# Altium schematic sheet CH340G_Test.SchDoc
size A4
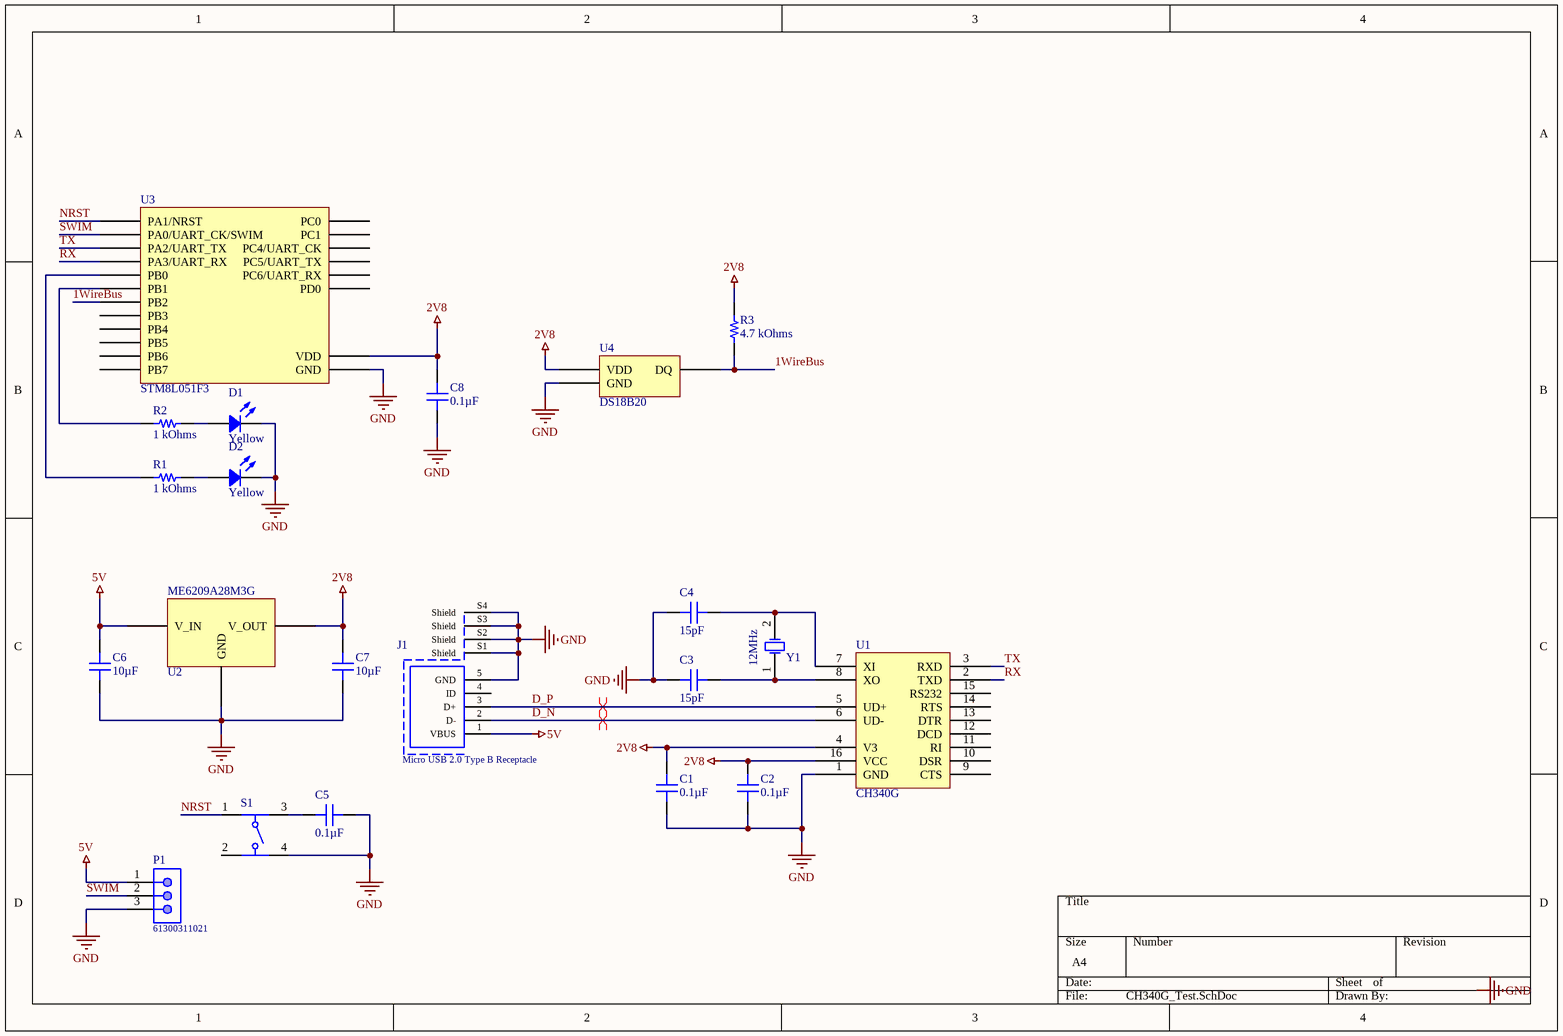
[diagram p0: CH340G_Test.SchDoc]

## Parts
C1  value 0.1µF  [CAP 0805_2012]  (hidden comment: 100nF)
C2  value 0.1µF  [CAP 0805_2012]  (hidden comment: 100nF)
C3  15pF  [CAP 0805_2012]
C4  15pF  [CAP 0805_2012]
C5  value 0.1µF  [CAP 0805_2012]  (hidden comment: 100nF)
C6  value 10µF  [CAP 0805_2012]  (hidden comment: 10uF)
C7  value 10µF  [CAP 0805_2012]  (hidden comment: 10uF)
C8  value 0.1µF  [CAP 0805_2012]  (hidden comment: 100nF)
D1  Yellow  [LED 0603_1608 YELLOW]
D2  Yellow  [LED 0603_1608 YELLOW]
J1  Micro USB 2.0 Type B Receptacle  [629105136821]
P1  61300311021  [61300311021]
R1  value 1 kOhms  [RES 0805_2012]  (hidden comment: 1k)
R2  value 1 kOhms  [RES 0805_2012]  (hidden comment: 1k)
R3  value 4.7 kOhms  [RES 0805_2012]  (hidden comment: 4K7)
S1  (no value)  [4301x60507x6]
U1  CH340G  [CH340G]
U2  ME6209A28M3G  [SOT95P285X150-3N]
U3  STM8L051F3  [TSOP65P630X120-20N]
U4  DS18B20  [DS18B20]
Y1  12MHz  [WE-XTAL_HC49/4H]

## Nets
2V8: C1.2 C2.2 C7.2 C8.1 R3.2 U1.4(V3) U1.16(VCC) U2.2(V_OUT) U3.8(VDD) U4.3(VDD)
5V: C6.2 J1.1(VBUS) P1.1 U2.3(V_IN)
GND: C1.1 C2.1 C3.1 C4.1 C5.1 C6.1 C7.1 C8.2 D1.2 D2.2 J1.5(GND) J1.S1(Shield) J1.S2(Shield) J1.S3(Shield) J1.S4(Shield) P1.3 S1.4 U1.1(GND) U2.1(GND) U3.7(GND) U4.1(GND)
1WireBus: R3.1 U3.12(PB2) U4.2(DQ)
D_N: J1.2(D-) U1.6(UD-)
D_P: J1.3(D+) U1.5(UD+)
NRST: S1.1 U3.4(PA1/NRST)
RX: U1.2(TXD) U3.6(PA3/UART_RX)
SWIM: P1.2 U3.3(PA0/UART_CK/SWIM)
TX: U1.3(RXD) U3.5(PA2/UART_TX)
NetC3_2: C3.2 U1.8(XO) Y1.1(OSC1)
NetC4_2: C4.2 U1.7(XI) Y1.2(OSC2)
NetC5_2: C5.2 S1.3
NetD1_1: D1.1 R2.2
NetD2_1: D2.1 R1.2
NetR1_1: R1.1 U3.10(PB0)
NetR2_1: R2.1 U3.11(PB1)

Not connected (* = marked no-connect by the designer): J1 4(ID); S1 2; U1 9(CTS) 10(DSR) 11(RI) 12(DCD) 13(DTR) 14(RTS) 15(RS232); U3 1(PC5/UART_TX) 2(PC6/UART_RX) 9(PD0) 13(PB3) 14(PB4) 15(PB5) 16(PB6) 17(PB7) 18(PC0) 19(PC1) 20(PC4/UART_CK)

## Layout directives
differential pair: D_N, D_P

## Notes on the sheet
- Labels drawn without touching a wire or pin: GND

## Library data of the parts
C1 C2 C5 C8 = AC0805KKX8R9BB104: CAP CER 0805 10% X8R 50V 100NF; Manufacturer: Yageo; Part Number: AC0805KKX8R9BB104; Applications: Automotive; Capacitance: 0.1µF; ComponentLink1Description: Datasheet; ComponentLink1URL: http://www.yageo.com/documents/recent/AC0805KKX8R9BB104.pdf; ComponentLink2Description: DigiKey Link; ComponentLink2URL: http://digikey.com/product-detail/en/yageo/AC0805KKX8R9BB104/311-4624-1-ND/9699550; Device Package: 0805 (2012 Metric); LastUpdated: 21/01/2020 00:02:48; Lifecycle Status: Active; Minimum Order: 1; Mounting Type: Surface Mount, MLCC; Operating Temperature: -55°C ~ 150°C; Package / Case: 0805 (2012 Metric); Packaging: TapeAndReel; PartId: 14076; Part Status: Active; Price: 0.06; Ratings: AEC-Q200; Series: AC; Size / Dimension: 0.079" L x 0.049" W (2.00mm x 1.25mm); Supplier 1: DigiKey; Supplier Part Number 1: 311-4624-1-ND; Temperature Coefficient: X8R; Thickness (Max): 0.057" (1.45mm); Tolerance: ±10%; Voltage - Rated: 50V
C3 C4 = 885012007029: CAP CER 15PF 25V C0G/NP0 0805; Manufacturer: Würth Elektronik; Temperature Coefficient: C0G, NP0; Tolerance: ±5%; Part Number: 885012007029; Value: 15pF; Applications: General Purpose; Capacitance: 15pF; ComponentLink1Description: Datasheet; ComponentLink1URL: https://katalog.we-online.de/pbs/datasheet/885012007029.pdf; ComponentLink2Description: DigiKey Link; ComponentLink2URL: http://digikey.com/product-detail/en/w-rth-elektronik/885012007029/732-7828-1-ND/5454455; Device Package: 0805 (2012 Metric); LastUpdated: 21/01/2020 00:03:03; Lifecycle Status: Active; Minimum Order: 1; Mounting Type: Surface Mount, MLCC; Operating Temperature: -55°C ~ 125°C; Package / Case: 0805 (2012 Metric); Packaging: TapeAndReel; PartId: 4245; Part Status: Active; Price: 0.03; Series: WCAP-CSGP; Size / Dimension: 0.079" L x 0.049" W (2.00mm x 1.25mm); Supplier 1: DigiKey; Supplier Part Number 1: 732-7828-1-ND; Thickness (Max): 0.028" (0.70mm); Voltage - Rated: 25V
C6 C7 = C0805X106K9RAC7800: CAP CER 10UF 6.3V X7R 0805; Manufacturer: KEMET; Tolerance: ±10%; Part Number: C0805X106K9RAC7800; Applications: Boardflex Sensitive; Capacitance: 10µF; ComponentLink1Description: Datasheet; ComponentLink1URL: https://api.kemet.com/component-edge/download/datasheet/C0805X106K9RAC7800.pdf; ComponentLink2Description: DigiKey Link; ComponentLink2URL: http://digikey.com/product-detail/en/kemet/C0805X106K9RAC7800/399-15697-1-ND/7427577; Device Package: 0805 (2012 Metric); Features: Soft Termination; LastUpdated: 21/01/2020 00:03:05; Lifecycle Status: Active; Minimum Order: 1; Mounting Type: Surface Mount, MLCC; Operating Temperature: -55°C ~ 125°C; Package / Case: 0805 (2012 Metric); Packaging: TapeAndReel; PartId: 2913; Part Status: Active; Price: 0.24; Series: SMD Comm X7R Flex; Size / Dimension: 0.079" L x 0.049" W (2.00mm x 1.25mm); Supplier 1: DigiKey; Supplier Part Number 1: 399-15697-1-ND; Temperature Coefficient: X7R; Thickness (Max): 0.057" (1.45mm); Voltage - Rated: 6.3V
D1 D2 = BL-HKC36D-AV-TRB: 0603 YELLOW; Manufacturer: American Bright Optoelectronics Corporation; Configuration: 0603; Current - Test: 20mA; Lens Color: Colorless; Lens Size: 0.87mm x 0.80mm; Lens Style: Rectangle with Flat Top; Lens Transparency: Clear; Millicandela Rating: 120mcd; Viewing Angle: 120°; Voltage - Forward (Vf) (Typ): 2V; Wavelength - Dominant: 589nm; Wavelength - Peak: 590nm; Part Number: BL-HKC36D-AV-TRB; Color: Yellow; ComponentLink1Description: Datasheet; ComponentLink1URL: http://americanbrightled.com/pdffiles/smt/BL-HKC36D-AV-TRB.pdf; ComponentLink2Description: DigiKey Link; ComponentLink2URL: http://digikey.com/product-detail/en/american-bright-optoelectronics-corporation/BL-HKC36D-AV-TRB/BL-HKC36D-AV-TRBCT-ND/9678339; Device Package: 0603 (1608 Metric); Height (Max): 0.85mm; LastUpdated: 21/01/2020 03:15:05; Lifecycle Status: Active; Minimum Order: 1; Mounting Type: Surface Mount; Package / Case: 0603 (1608 Metric); Packaging: TapeAndReel; PartId: 82; Part Status: Active; Price: 0.06; Series: -; Size / Dimension: 1.60mm L x 0.80mm W; Supplier 1: DigiKey; Supplier Part Number 1: BL-HKC36D-AV-TRBCT-ND; Supplier Device Package: 0603; Value: Yellow
J1 = 629105136821: Micro USB 2.0 Type B, Receptacle, Horizontal, SMT; Rated Current: 1A; Pin Number: 5; Interface Type: Type B; Working Voltage: 30VAC; ComponentLink1Description: Manufacturer; ComponentLink1URL: http://www.we-online.de; ComponentLink2Description: Datasheet; ComponentLink2URL: https://katalog.we-online.com/em/datasheet/629105136821.pdf; Published Date: September 2019; Publisher: Wurth Elektronik; Part Number: 629105136821; Gender: Receptacle; Type: Horizontal; Packaging: Tape and Reel; Operating Temperature: -40 to +105degC; Mounting Technology: SMT; Application: Micro USB 2.0
P1 = 61300311021: WR-PHD Pin Header, THT, pitch 2.54mm, Single Row, Angled, 3p; Manufacturer: Wurth Elektronik; Pin Number: 3; Rated Current: 3A; Working Voltage: 250VAC; Withstanding Voltage: 500VAC; Contact Resistance: 20mOhm; ComponentLink1Description: Manufacturer; ComponentLink1URL: http://www.we-online.de; ComponentLink2Description: Datasheet; ComponentLink2URL: https://www.we-online.com/catalog/datasheet/61300311021.pdf; Manufacturer Part Number: 61300311021; Published Date: May 2020; Pitch: 2.54mm; Operating Temperature: -40 to +105degC; Mounting Technology: THT; Packaging: Bag; Gender: Pin Header; Row Number: Single; Orientation: Angled
R1 R2 = RCG08051K00FKEA: RES SMD 1K OHM 1% 1/8W 0805; Manufacturer: Vishay Dale; Power (Watts): 0.125W, 1/8W; Temperature Coefficient: ±100ppm/°C; Part Number: RCG08051K00FKEA; ComponentLink1Description: Datasheet; ComponentLink1URL: http://www.vishay.com/docs/20047/rcge3.pdf; ComponentLink2Description: DigiKey Link; ComponentLink2URL: http://digikey.com/product-detail/en/vishay-dale/RCG08051K00FKEA/541-1817-1-ND/4172576; Composition: Thick Film; Device Package: 0805 (2012 Metric); Height - Seated (Max): 0.020" (0.50mm); LastUpdated: 21/01/2020 01:49:21; Lifecycle Status: Active; Minimum Order: 1; Number of Terminations: 2; Operating Temperature: -55°C ~ 155°C; Package / Case: 0805 (2012 Metric); Packaging: TapeAndReel; PartId: 29401; Part Status: Active; Price: 0.01; Resistance: 1 kOhms; Series: RCG; Size / Dimension: 0.079" L x 0.049" W (2.00mm x 1.25mm); Supplier 1: DigiKey; Supplier Part Number 1: 541-1817-1-ND; Supplier Device Package: 0805; Tolerance: ±1%
R3 = RCS08054K70JNEA: RES SMD 4.7K OHM 5% 0.4W 0805; Manufacturer: Vishay Dale; Power (Watts): 0.4W, 2/5W; Temperature Coefficient: ±200ppm/°C; Part Number: RCS08054K70JNEA; ComponentLink1Description: Datasheet; ComponentLink1URL: http://www.vishay.com/docs/20065/rcse3.pdf; ComponentLink2Description: DigiKey Link; ComponentLink2URL: http://digikey.com/product-detail/en/vishay-dale/RCS08054K70JNEA/541-2866-1-ND/5867159; Composition: Thick Film; Device Package: 0805 (2012 Metric); Features: Automotive AEC-Q200, Pulse Withstanding; Height - Seated (Max): 0.020" (0.50mm); LastUpdated: 21/01/2020 01:50:02; Lifecycle Status: Active; Minimum Order: 1; Number of Terminations: 2; Operating Temperature: -55°C ~ 155°C; Package / Case: 0805 (2012 Metric); Packaging: TapeAndReel; PartId: 27839; Part Status: Active; Price: 0.02; Ratings: AEC-Q200; Resistance: 4.7 kOhms; Series: AccliMate™ RCU; Size / Dimension: 0.079" L x 0.049" W (2.00mm x 1.25mm); Supplier 1: DigiKey; Supplier Part Number 1: 541-2866-1-ND; Supplier Device Package: 0805; Tolerance: ±5%
S1 = 430156050726: WS-TATV THT Tact Switch 6x6mm, height 5mm, 260gf; Rated Voltage: 12VDC; Rated Current: 50mA; Washable: No; ComponentLink1Description: Manufacturer; ComponentLink1URL: http://www.we-online.de; ComponentLink2Description: Datasheet; ComponentLink2URL: https://katalog.we-online.com/em/datasheet/430156050726.pdf; Operating Temperature: -40 to +85degC; Part Number: 430156050726; Published Date: September 2019; Contact Material: Stainless Steel; Height: 5mm; Mounting Technology: THT; Contact Plating: Silver; Operation Force: 260gf; Packaging: Bulk; Terminal Material: Copper Alloy; Publisher: Wurth Elektronik; Terminal Plating: Silver
U2 = ME6209
Y1 = 830014948B: WE-XTAL Quartz Crystal, size HC49 12MHz; Frequency Stability: 50ppm; Frequency Tolerance: +/-30ppm; Frequency: 27.12MHz; ComponentLink1Description: Manufacturer; ComponentLink1URL: http://www.we-online.de; ComponentLink2Description: Datasheet; ComponentLink2URL: https://katalog.we-online.com/pbs/datasheet/830014948B.pdf; Part Number: 830014948B; Published Date: March 2019; Publisher: Wurth Elektronik; Size: HC49-4H; Operating Temperature: -10 up to +60degC; Mounting Technology: THT; Packaging: Bulk; Load Capacitance: -